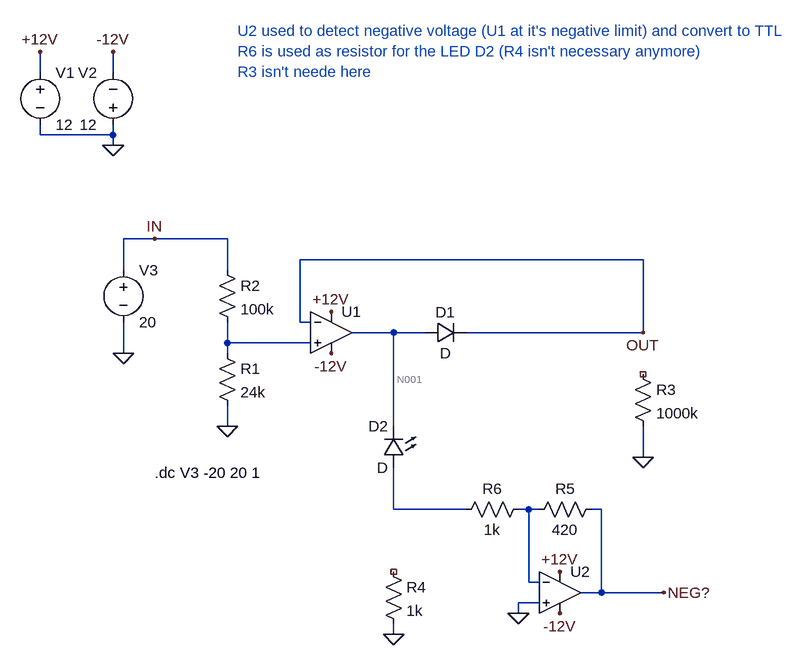
[diagram p0: schematic PrecisionRectifier.asc]
PrecisionRectifier.asc, the LTspice schematic file:
Version 4
SHEET 1 880 680
WIRE -496 -256 -496 -288
WIRE -384 -256 -384 -288
WIRE -496 -160 -496 -176
WIRE -384 -160 -384 -176
WIRE -384 -160 -496 -160
WIRE -384 -144 -384 -160
WIRE -320 0 -368 0
WIRE -208 0 -320 0
WIRE 432 32 -96 32
WIRE -368 48 -368 0
WIRE -208 48 -208 0
WIRE -96 128 -96 32
WIRE -80 128 -96 128
WIRE 48 144 -16 144
WIRE 96 144 48 144
WIRE 432 144 432 32
WIRE 432 144 160 144
WIRE -208 160 -208 128
WIRE -80 160 -208 160
WIRE -368 176 -368 128
WIRE -208 176 -208 160
WIRE -208 288 -208 256
WIRE 48 288 48 144
WIRE 432 336 432 288
WIRE 48 416 48 352
WIRE 160 416 48 416
WIRE 256 416 240 416
WIRE 272 416 256 416
WIRE 368 416 352 416
WIRE 256 528 256 416
WIRE 272 528 256 528
WIRE 368 544 368 416
WIRE 368 544 336 544
WIRE 464 544 368 544
WIRE 272 560 240 560
WIRE 240 576 240 560
WIRE 48 608 48 592
FLAG -208 288 0
FLAG -384 -144 0
FLAG -368 176 0
FLAG 432 336 0
FLAG 48 608 0
FLAG 240 576 0
FLAG -496 -288 +12V
FLAG -384 -288 -12V
FLAG -48 112 +12V
FLAG 304 512 +12V
FLAG -48 176 -12V
FLAG 304 576 -12V
FLAG 432 144 OUT
FLAG 464 544 NEG?
FLAG -320 0 IN
SYMBOL Opamps\\UniversalOpamp2 -48 144 R0
SYMATTR InstName U1
SYMBOL res -224 160 R0
SYMATTR InstName R1
SYMATTR Value 24k
SYMBOL res -224 32 R0
SYMATTR InstName R2
SYMATTR Value 100k
SYMBOL voltage -496 -272 R0
WINDOW 123 0 0 Left 0
WINDOW 39 0 0 Left 0
SYMATTR InstName V1
SYMATTR Value 12
SYMBOL voltage -384 -160 R180
WINDOW 0 24 96 Left 2
WINDOW 3 24 16 Left 2
WINDOW 123 0 0 Left 0
WINDOW 39 0 0 Left 0
SYMATTR InstName V2
SYMATTR Value 12
SYMBOL voltage -368 32 R0
WINDOW 123 0 0 Left 0
WINDOW 39 0 0 Left 0
SYMATTR InstName V3
SYMATTR Value 20
SYMBOL diode 96 160 R270
WINDOW 0 32 32 VTop 2
WINDOW 3 0 32 VBottom 2
SYMATTR InstName D1
SYMBOL res 416 192 R0
SYMATTR InstName R3
SYMATTR Value 1000k
SYMBOL LED 64 352 R180
WINDOW 0 24 64 Left 2
WINDOW 3 24 0 Left 2
SYMATTR InstName D2
SYMBOL res 32 496 R0
SYMATTR InstName R4
SYMATTR Value 1k
SYMBOL Opamps\\UniversalOpamp2 304 544 R0
SYMATTR InstName U2
SYMBOL res 368 400 R90
WINDOW 0 0 56 VBottom 2
WINDOW 3 32 56 VTop 2
SYMATTR InstName R5
SYMATTR Value 420
SYMBOL res 256 400 R90
WINDOW 0 0 56 VBottom 2
WINDOW 3 32 56 VTop 2
SYMATTR InstName R6
SYMATTR Value 1k
TEXT -320 360 Left 2 !.dc V3 -20 20 1
TEXT -192 -320 Left 2 ;U2 used to detect negative voltage (U1 at it's negative limit) and convert to TTL\nR6 is used as resistor for the LED D2 (R4 isn't necessary anymore)\nR3 isn't neede here

The netlist it stands for:
* PrecisionRectifier.asc
XU1 N002 OUT +12V -12V N001 level.2 Avol=1Meg GBW=10Meg Slew=10Meg ilimit=25m rail=0 Vos=0 phimargin=45 en=0 enk=0 in=0 ink=0 Rin=500Meg  ; pins IN+ IN- V+ V- OUT
R1 N002 0 24k
R2 IN N002 100k
V1 +12V 0 12
V2 0 -12V 12
V3 IN 0 20
D1 N001 OUT D
R3 NC_01 0 1000k
D2 N003 N001 D
R4 NC_02 0 1k
XU2 0 N004 +12V -12V NEG? level.2 Avol=1Meg GBW=10Meg Slew=10Meg ilimit=25m rail=0 Vos=0 phimargin=45 en=0 enk=0 in=0 ink=0 Rin=500Meg  ; pins IN+ IN- V+ V- OUT
R5 NEG? N004 420
R6 N004 N003 1k
.model D D
.lib standard.dio
.dc V3 -20 20 1
* U2 used to detect negative voltage (U1 at it's negative limit) and convert to TTL
* R6 is used as resistor for the LED D2 (R4 isn't necessary anymore)
* R3 isn't neede here
.lib UniversalOpamps2.sub
.backanno
.end

* Results of the author's LTspice run, read from the files saved beside the schematic
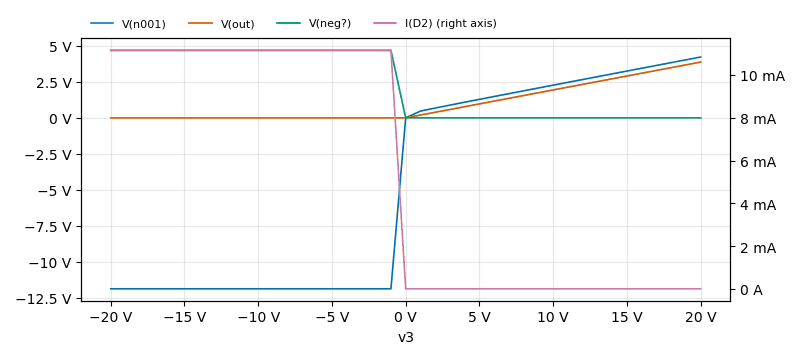
[diagram p1: DC transfer characteristic of PrecisionRectifier.asc, plotted from the saved traces]
* DC transfer characteristic, 1 run:
*   V(n001): -11.87 V at v3=-20 V, 4.222 V at v3=20 V, min -11.87 V, max 4.222 V
*   V(out): -5.937 mV at v3=-20 V, 3.871 V at v3=20 V, min -5.937 mV, max 3.871 V
*   V(neg?): 4.684 V at v3=-20 V, -1.777 nV at v3=20 V, min -1.777 nV, max 4.684 V
*   I(D2): 11.15 mA at v3=-20 V, -4.232 pA at v3=20 V, min -4.232 pA, max 11.15 mA